# EAGLE design Santa (EAGLE 7.6.0)
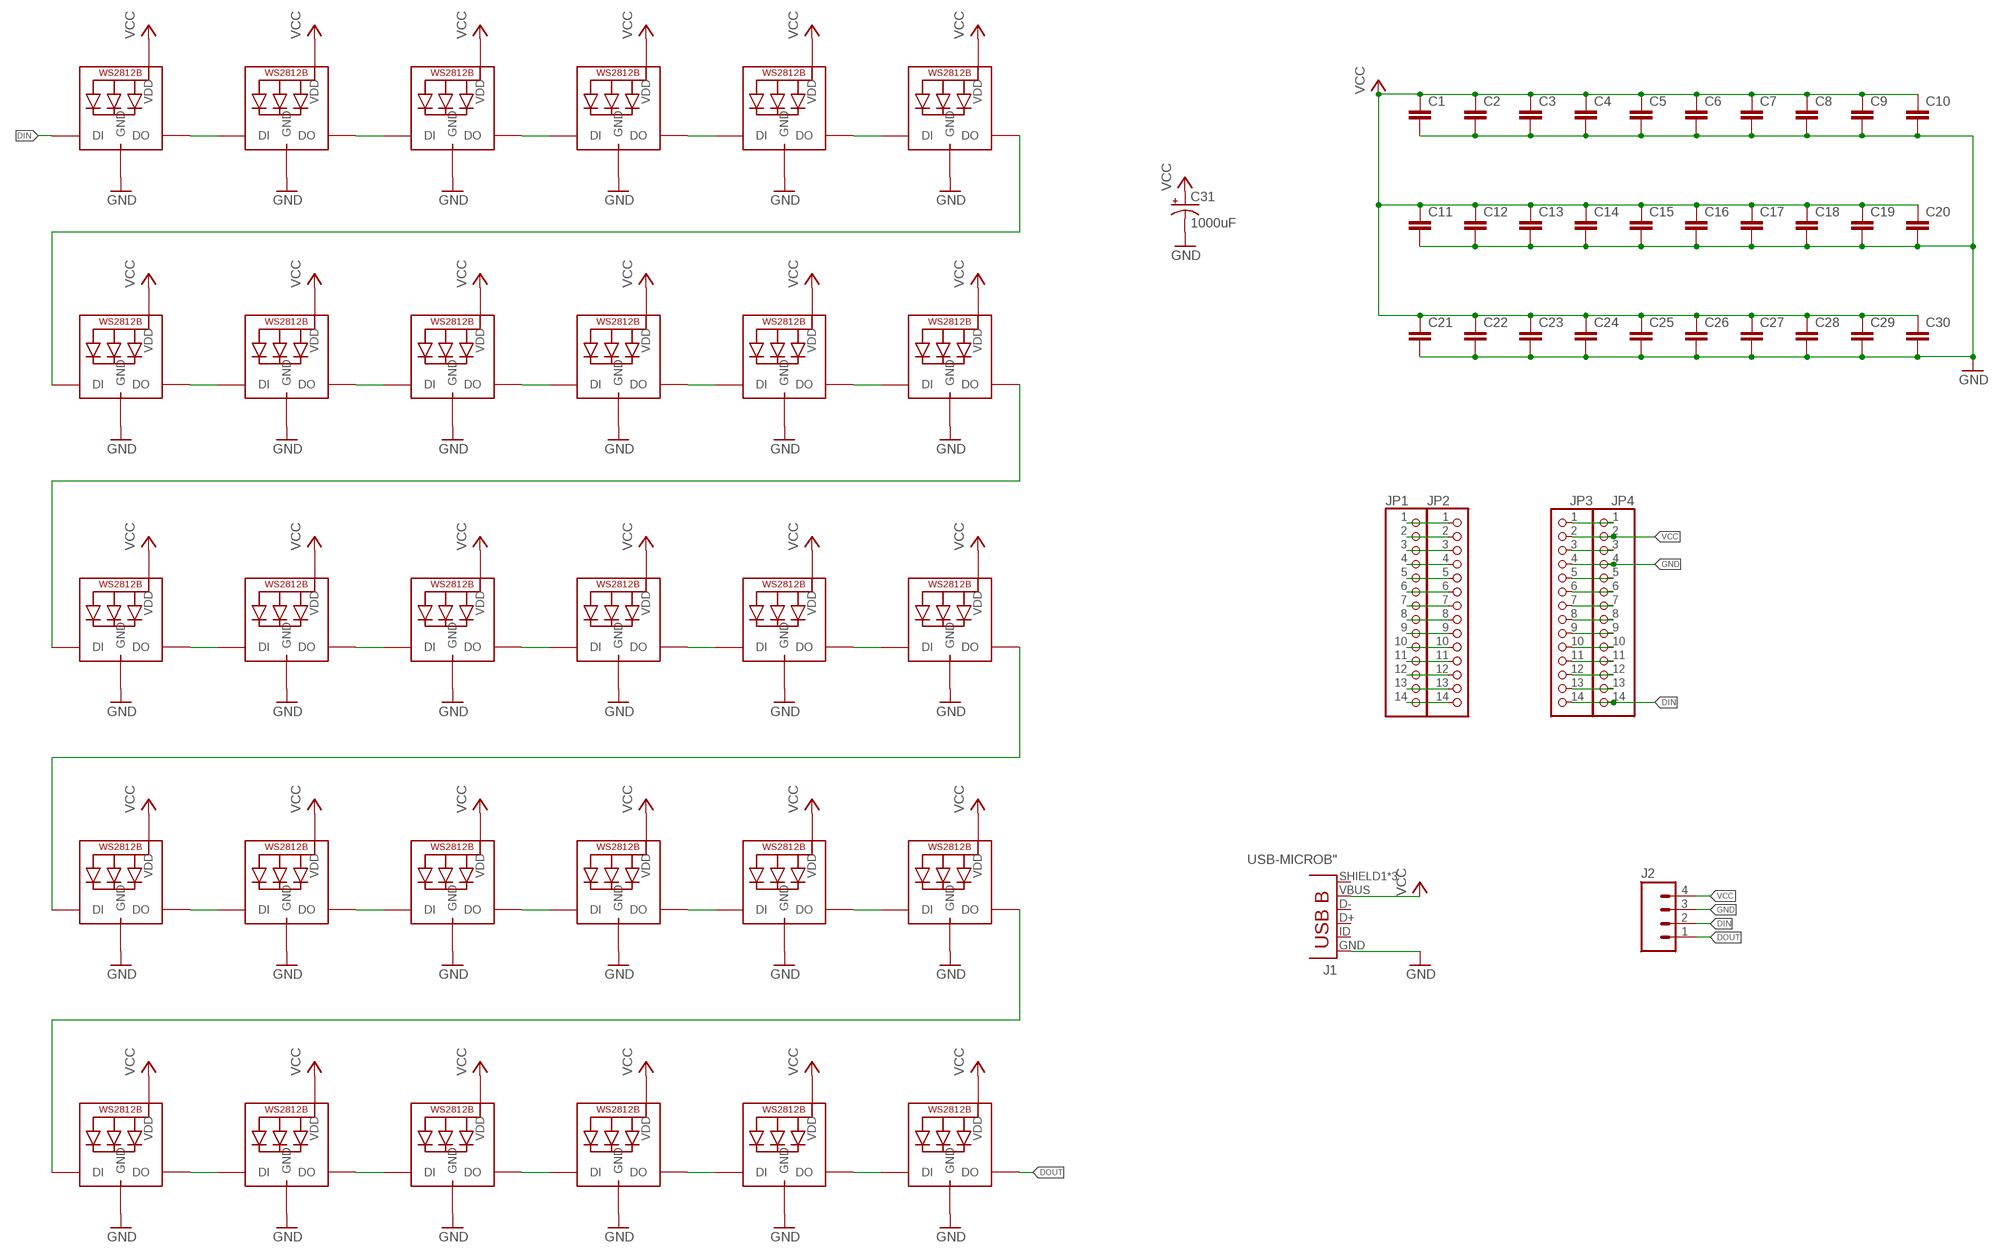
[diagram p0: schematic, sheet 1]

## Parts
C1  CC0603  [C0603]
C2  CC0603  [C0603]
C3  CC0603  [C0603]
C4  CC0603  [C0603]
C5  CC0603  [C0603]
C6  CC0603  [C0603]
C7  CC0603  [C0603]
C8  CC0603  [C0603]
C9  CC0603  [C0603]
C10  CC0603  [C0603]
C11  CC0603  [C0603]
C12  CC0603  [C0603]
C13  CC0603  [C0603]
C14  CC0603  [C0603]
C15  CC0603  [C0603]
C16  CC0603  [C0603]
C17  CC0603  [C0603]
C18  CC0603  [C0603]
C19  CC0603  [C0603]
C20  CC0603  [C0603]
C21  CC0603  [C0603]
C22  CC0603  [C0603]
C23  CC0603  [C0603]
C24  CC0603  [C0603]
C25  CC0603  [C0603]
C26  CC0603  [C0603]
C27  CC0603  [C0603]
C28  CC0603  [C0603]
C29  CC0603  [C0603]
C30  CC0603  [C0603]
C31  1000uF  CPOL-USSMCC  [SMC_C]
J1  USB-MICROB"  [USB-B-MICRO-SMD_V03]
J2  M04LOCK_LONGPADS  [1X04_LOCK_LONGPADS]
JP1  PINHD-1X14-CB  [1X14-CB]
JP2  PINHD-1X14-CB  [1X14-CB]
JP3  PINHD-1X14-CB  [1X14-CB]
JP4  PINHD-1X14-CB  [1X14-CB]
LED1  WS2812B5050  [WS2812B]
LED2  WS2812B5050  [WS2812B]
LED3  WS2812B5050  [WS2812B]
LED4  WS2812B5050  [WS2812B]
LED5  WS2812B5050  [WS2812B]
LED6  WS2812B5050  [WS2812B]
LED7  WS2812B5050  [WS2812B]
LED8  WS2812B5050  [WS2812B]
LED9  WS2812B5050  [WS2812B]
LED10  WS2812B5050  [WS2812B]
LED11  WS2812B5050  [WS2812B]
LED12  WS2812B5050  [WS2812B]
LED13  WS2812B5050  [WS2812B]
LED14  WS2812B5050  [WS2812B]
LED15  WS2812B5050  [WS2812B]
LED16  WS2812B5050  [WS2812B]
LED17  WS2812B5050  [WS2812B]
LED18  WS2812B5050  [WS2812B]
LED19  WS2812B5050  [WS2812B]
LED20  WS2812B5050  [WS2812B]
LED21  WS2812B5050  [WS2812B]
LED22  WS2812B5050  [WS2812B]
LED23  WS2812B5050  [WS2812B]
LED24  WS2812B5050  [WS2812B]
LED25  WS2812B5050  [WS2812B]
LED26  WS2812B5050  [WS2812B]
LED27  WS2812B5050  [WS2812B]
LED28  WS2812B5050  [WS2812B]
LED29  WS2812B5050  [WS2812B]
LED30  WS2812B5050  [WS2812B]

## Nets
DIN: J2.2 JP3.14 JP4.14 LED1.4-DIN(DI)
DOUT: J2.1 LED30.2-DOUT(DO)
GND: C1.2 C2.2 C3.2 C4.2 C5.2 C6.2 C7.2 C8.2 C9.2 C10.2 C11.2 C12.2 C13.2 C14.2 C15.2 C16.2 C17.2 C18.2 C19.2 C20.2 C21.2 C22.2 C23.2 C24.2 C25.2 C26.2 C27.2 C28.2 C29.2 C30.2 C31.- J1.GND J2.3 JP3.4 JP4.4 LED1.3-GND(GND) LED2.3-GND(GND) LED3.3-GND(GND) LED4.3-GND(GND) LED5.3-GND(GND) LED6.3-GND(GND) LED7.3-GND(GND) LED8.3-GND(GND) LED9.3-GND(GND) LED10.3-GND(GND) LED11.3-GND(GND) LED12.3-GND(GND) LED13.3-GND(GND) LED14.3-GND(GND) LED15.3-GND(GND) LED16.3-GND(GND) LED17.3-GND(GND) LED18.3-GND(GND) LED19.3-GND(GND) LED20.3-GND(GND) LED21.3-GND(GND) LED22.3-GND(GND) LED23.3-GND(GND) LED24.3-GND(GND) LED25.3-GND(GND) LED26.3-GND(GND) LED27.3-GND(GND) LED28.3-GND(GND) LED29.3-GND(GND) LED30.3-GND(GND)
N$1: LED1.2-DOUT(DO) LED2.4-DIN(DI)
N$2: LED2.2-DOUT(DO) LED3.4-DIN(DI)
N$3: LED3.2-DOUT(DO) LED4.4-DIN(DI)
N$4: LED4.2-DOUT(DO) LED5.4-DIN(DI)
N$5: LED5.2-DOUT(DO) LED6.4-DIN(DI)
N$6: LED7.2-DOUT(DO) LED8.4-DIN(DI)
N$7: LED8.2-DOUT(DO) LED9.4-DIN(DI)
N$8: LED9.2-DOUT(DO) LED10.4-DIN(DI)
N$9: LED10.2-DOUT(DO) LED11.4-DIN(DI)
N$10: LED11.2-DOUT(DO) LED12.4-DIN(DI)
N$11: LED13.2-DOUT(DO) LED14.4-DIN(DI)
N$12: LED14.2-DOUT(DO) LED15.4-DIN(DI)
N$13: LED15.2-DOUT(DO) LED16.4-DIN(DI)
N$14: LED16.2-DOUT(DO) LED17.4-DIN(DI)
N$15: LED17.2-DOUT(DO) LED18.4-DIN(DI)
N$16: LED19.2-DOUT(DO) LED20.4-DIN(DI)
N$17: LED20.2-DOUT(DO) LED21.4-DIN(DI)
N$18: LED21.2-DOUT(DO) LED22.4-DIN(DI)
N$19: LED22.2-DOUT(DO) LED23.4-DIN(DI)
N$20: LED23.2-DOUT(DO) LED24.4-DIN(DI)
N$21: LED25.2-DOUT(DO) LED26.4-DIN(DI)
N$22: LED26.2-DOUT(DO) LED27.4-DIN(DI)
N$23: LED27.2-DOUT(DO) LED28.4-DIN(DI)
N$24: LED28.2-DOUT(DO) LED29.4-DIN(DI)
N$25: LED29.2-DOUT(DO) LED30.4-DIN(DI)
N$26: LED6.2-DOUT(DO) LED7.4-DIN(DI)
N$27: LED12.2-DOUT(DO) LED13.4-DIN(DI)
N$28: LED18.2-DOUT(DO) LED19.4-DIN(DI)
N$29: LED24.2-DOUT(DO) LED25.4-DIN(DI)
N$30: JP1.1 JP2.1
N$31: JP1.2 JP2.2
N$32: JP1.3 JP2.3
N$33: JP1.4 JP2.4
N$34: JP1.5 JP2.5
N$35: JP1.6 JP2.6
N$36: JP1.7 JP2.7
N$37: JP1.8 JP2.8
N$38: JP1.9 JP2.9
N$39: JP1.10 JP2.10
N$40: JP1.11 JP2.11
N$41: JP1.12 JP2.12
N$42: JP1.13 JP2.13
N$43: JP1.14 JP2.14
N$44: JP3.1 JP4.1
N$46: JP3.3 JP4.3
N$48: JP3.5 JP4.5
N$49: JP3.6 JP4.6
N$50: JP3.7 JP4.7
N$51: JP3.8 JP4.8
N$52: JP3.9 JP4.9
N$53: JP3.10 JP4.10
N$54: JP3.11 JP4.11
N$55: JP3.12 JP4.12
N$56: JP3.13 JP4.13
VCC: C1.1 C2.1 C3.1 C4.1 C5.1 C6.1 C7.1 C8.1 C9.1 C10.1 C11.1 C12.1 C13.1 C14.1 C15.1 C16.1 C17.1 C18.1 C19.1 C20.1 C21.1 C22.1 C23.1 C24.1 C25.1 C26.1 C27.1 C28.1 C29.1 C30.1 C31.+ J1.VBUS J2.4 JP3.2 JP4.2 LED1.1-VDD(VDD) LED2.1-VDD(VDD) LED3.1-VDD(VDD) LED4.1-VDD(VDD) LED5.1-VDD(VDD) LED6.1-VDD(VDD) LED7.1-VDD(VDD) LED8.1-VDD(VDD) LED9.1-VDD(VDD) LED10.1-VDD(VDD) LED11.1-VDD(VDD) LED12.1-VDD(VDD) LED13.1-VDD(VDD) LED14.1-VDD(VDD) LED15.1-VDD(VDD) LED16.1-VDD(VDD) LED17.1-VDD(VDD) LED18.1-VDD(VDD) LED19.1-VDD(VDD) LED20.1-VDD(VDD) LED21.1-VDD(VDD) LED22.1-VDD(VDD) LED23.1-VDD(VDD) LED24.1-VDD(VDD) LED25.1-VDD(VDD) LED26.1-VDD(VDD) LED27.1-VDD(VDD) LED28.1-VDD(VDD) LED29.1-VDD(VDD) LED30.1-VDD(VDD)
Unconnected: J1.D+ J1.D- J1.ID(USBID) J1.SHIELD1(SHIELD) J1.SHIELD2(SHIELD) J1.SHIELD3(SHIELD)

## Library data of the parts
C1-C30 = eagle-ltspice:C: CAPACITOR, European symbol; SPICEMODEL: NONE; SPICEPREFIX: C
C31 = rcl:CPOL-US: POLARIZED CAPACITOR, American symbol
J1 = SparkFun-Connectors:USB-MICROB; PROD_ID: CONN-11752
J2 = SparkFun-Connectors:M04: Header 4 Standard 4-pin 0.1" header. Use with straight break away headers (SKU : PRT-00116), right angle break away headers (PRT-00553), swiss pins (PRT-00743), machine pins (PRT-00117), and female headers (PRT-00115). Molex polarized connector foot print use with SKU : PRT-08231 with associated crimp pins and housings. 1MM SMD Version SKU: PRT-10208; PROD_ID: CONN-09696
JP1-JP4 = adafruit:PINHD-1X14: PIN HEADER
LED1-LED30 = adafruit:WS2812B

## Board
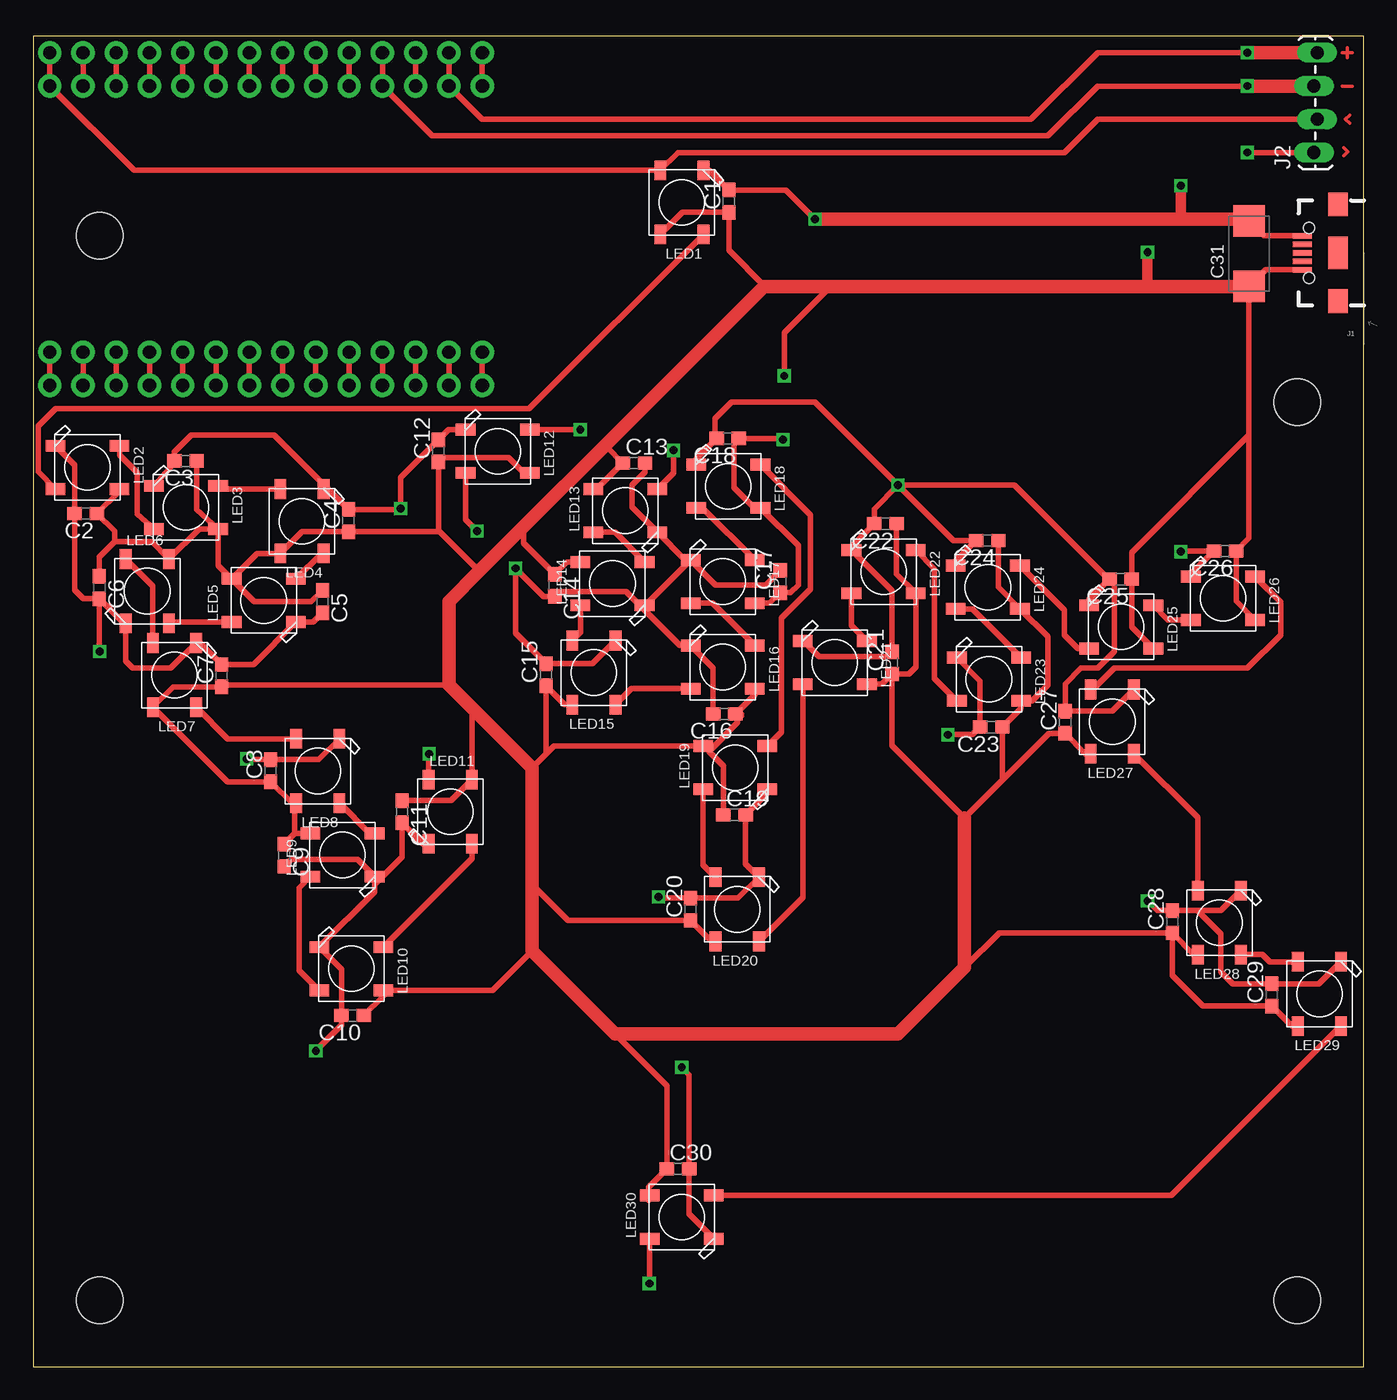
[diagram p1: board, top side]
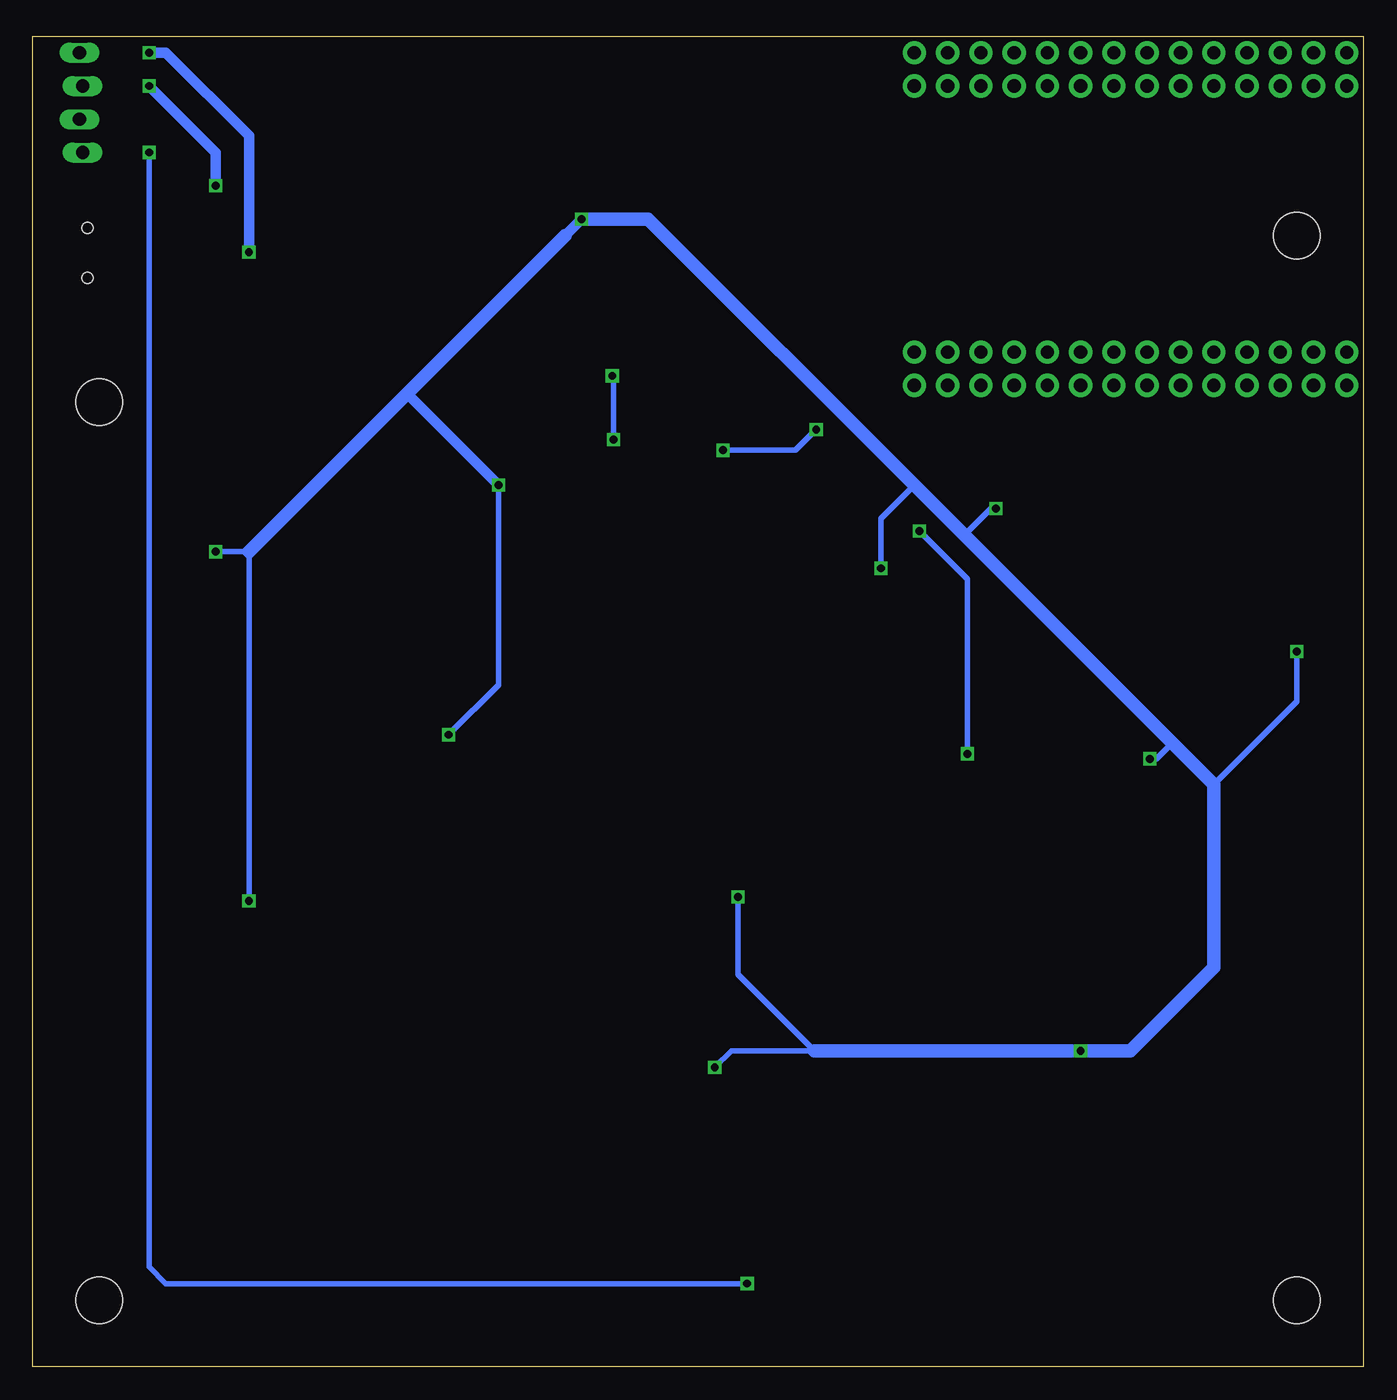
[diagram p2: board, bottom side, seen from below]

Size 101.6 x 101.6 mm. Coordinates in mm from the lower left corner, seen from the top.
Outline: 0,0 101.6,0 101.6,101.6 0,101.6 0,0
Copper layers (1*16): Top 0.035mm / dielectric 1.5mm / Bottom 0.035mm
Design rules "default": minimum track width 10mil, minimum drill 24mil, track to track 8mil, track to pad 8mil, pad to pad 8mil, via to via 8mil, smd to smd 8mil, copper to edge 40mil, drill to drill 8mil, minimum pad ring 10mil, minimum via ring 8mil, stop-mask expansion 4mil, vias tented up to drill 0mil, thermal gap 10mil
Holes 3.56 mm at 5.08,5.08 96.52,5.08 96.52,73.66 5.08,86.36

### Footprints (pad centres in the part's own frame; a part is rotated, then mirrored left to right if it is on the bottom)
C0603 = smd 1.1 x 1: 1 -0.85,0; 2 0.85,0
SMC_C = smd 2.4 x 2.4: + -2.5,0; - 2.5,0
USB-B-MICRO-SMD_V03 = smd 1.45 x 0.4: D+ 2.725,0; D- 2.725,0.65; GND 2.725,-1.3; ID 2.725,-0.65; VBUS 2.725,1.3 | smd 1.5 x 1.8: SHIELD1 0,3.685; SHIELD2 0,-3.685 | smd 1.5 x 2.5: SHIELD3 0,0 | hole 0.85: 2.2,1.9; 2.2,-1.9
1X04_LOCK_LONGPADS = drill 1.016 long: 1 0,0; 2 2.54,-0.254; 3 5.08,0; 4 7.62,-0.254
1X14-CB = drill 1.016 pad 1.778: 1 -16.51,0; 2 -13.97,0; 3 -11.43,0; 4 -8.89,0; 5 -6.35,0; 6 -3.81,0; 7 -1.27,0; 8 1.27,0; 9 3.81,0; 10 6.35,0; 11 8.89,0; 12 11.43,0; 13 13.97,0; 14 16.51,0
WS2812B = smd 1.5 x 0.9: 1-VDD 2.45,-1.65; 2-DOUT 2.45,1.65; 3-GND -2.45,1.65; 4-DIN -2.45,-1.65

### Placement (x,y rotation side)
C1  53.12,88.99 90 top
C2  4.02,65.15 180 top
C3  11.64,69.17 180 top
C4  24.08,64.6 90 top
C5  22.1,58.42 270 top
C6  5.06,59.5 270 top
C7  14.41,52.77 90 top
C8  18.14,45.51 90 top
C9  19.15,39.05 270 top
C10  24.4,26.82 180 top
C11  28.17,42.37 270 top
C12  30.94,69.93 90 top
C13  45.87,69 0 top
C14  39.83,59.67 270 top
C15  39.16,52.83 90 top
C16  52.77,49.85 180 top
C17  57.05,59.95 90 top
C18  53.04,70.88 180 top
C19  53.55,42.14 0 top
C20  50.21,34.93 90 top
C21  65.59,53.74 90 top
C22  65.08,64.36 180 top
C23  73.16,48.83 180 top
C24  72.85,63.09 180 top
C25  83.03,60.13 180 top
C26  91.01,62.29 180 top
C27  78.8,49.21 90 top
C28  86.98,33.97 90 top
C29  94.57,28.39 90 top
C30  49.24,15.11 0 top
C31  92.84,84.98 90 top
J1  99.63,85.05 180 top
J2  97.79,92.71 90 top
JP1  17.78,74.93 180 top
JP2  17.78,77.47 180 top
JP3  17.78,97.79 180 top
JP4  17.78,100.33 180 top
LED1  49.53,88.9 270 top
LED2  4.15,68.66 0 top
LED3  11.68,65.62 0 top
LED4  20.53,64.56 270 top
LED5  17.61,58.5 180 top
LED6  8.72,59.22 90 top
LED7  10.79,52.81 270 top
LED8  21.74,45.49 270 top
LED9  23.62,39.07 180 top
LED10  24.3,30.39 0 top
LED11  31.86,42.38 90 top
LED12  35.48,69.89 0 top
LED13  45.21,65.36 180 top
LED14  44.24,59.8 180 top
LED15  42.82,53 270 top
LED16  52.66,53.42 0 top
LED17  52.66,59.94 0 top
LED18  53.09,67.23 0 top
LED19  53.62,45.74 180 top
LED20  53.76,34.93 270 top
LED21  61.21,53.76 0 top
LED22  64.94,60.71 0 top
LED23  72.98,52.49 0 top
LED24  72.9,59.52 0 top
LED25  83.08,56.49 0 top
LED26  90.85,58.67 0 top
LED27  82.4,49.25 270 top
LED28  90.57,33.91 270 top
LED29  98.21,28.47 270 top
LED30  49.53,11.43 180 top

### Tracks (layer width: path | path; a pad name or v marks a point on that pad's centre or on a via)
DIN
  Top 0.406: JP4.14 JP3.14 7.71,91.35 LED1.4-DIN 49.24,92.71 78.74,92.71 81.28,95.25 J2.2
DOUT  (via drill 0.6)
  Top 0.406: J2.1 v92.71,92.71 | v47.05,6.35 47.05,9.75 LED30.2-DOUT
  Bottom 0.406: v92.71,92.71 92.71,7.62 91.44,6.35 v47.05,6.35
GND  (via drill 0.6)
  Top 0.406: JP4.4 JP3.4 30.48,93.98 77.47,93.98 81.28,97.79 v92.71,97.79 | LED3.3-GND 10.79,68.99 C3.2 10.79,69.85 12.06,71.12 18.42,71.12 C4.2 | LED2.3-GND 3.17,68.84 C2.2 3.17,59.31 3.84,58.65 C6.2 | C4.2 22.53,67.01 LED4.3-GND | C6.2 6.93,56.77 LED6.3-GND 7.07,53.89 7.62,53.34 10.52,53.34 LED7.3-GND 12.77,55.26 C7.2 16.82,53.62 LED5.3-GND 21.38,56.85 C5.2 | LED8.3-GND 21.81,46.36 C8.2 16.38,46.36 v16.32,46.42 | C9.2 19.69,38.73 24.77,38.73 LED9.3-GND 26.07,36.83 | 46.31,58.15 45.28,59.18 40.2,59.18 C14.2 38.97,58.82 v36.83,60.96 36.83,56.02 C15.2 42.7,53.69 LED15.3-GND | 46.31,58.15 LED14.3-GND 46.76,58.15 LED17.3-GND | LED18.3-GND 50.64,69.33 C18.2 52.07,71 52.07,72.39 53.34,73.66 59.69,73.66 v66.04,67.31 | C17.2 55.94,59.69 52.12,59.69 LED17.3-GND | C16.2 51.92,53.37 LED16.3-GND 49.38,55.07 46.31,58.15 | LED19.3-GND 56.07,43.8 C19.2 54.4,38.38 LED20.3-GND 53.81,35.78 C20.2 47.85,35.78 v47.75,35.88 | LED21.3-GND 58.82,55.41 60.01,54.23 65.23,54.23 C21.2 65.59,59.25 LED22.3-GND 62.49,62.62 C22.2 64.23,65.5 v66.04,67.31 | LED23.3-GND 72.31,52.37 C23.2 71.73,48.26 v69.85,48.26 | LED24.3-GND 70.45,61.54 C24.2 70.25,63.09 v66.04,67.31 | LED27.3-GND 82.41,50.06 C27.2 78.8,52.13 80.01,53.34 81.28,53.34 82.55,54.61 82.55,59.69 | LED25.3-GND 80.63,58.58 C25.2 82.55,59.76 82.55,59.69 | LED26.3-GND 88.4,60.53 C26.2 87.69,62.29 v87.63,62.23 | LED28.3-GND 90.69,34.82 88.9,34.82 | 88.9,34.82 C28.2 85.83,34.82 v85.09,35.56 | LED29.3-GND 98.18,29.24 C29.2 91.6,29.24 90.68,30.16 90.68,33.05 88.9,34.82 | J1.GND 93.97,86.35 C31.- | LED1.3-GND 51.61,91.35 C1.2 57.48,89.84 v59.69,87.63
  Top 0.406: LED12.3-GND 31.71,71.55 C12.2 28.07,67.9 v28.07,65.53 27.99,65.45 C4.2 | C6.2 5.06,54.63 v5.08,54.61 | v21.59,24.13 23.55,26.09 C10.2 23.55,30.34 LED10.3-GND 26.07,36.27 26.07,36.83 | LED11.3-GND 29.77,39.92 C11.2 28.17,38.93 26.07,36.83 | C13.2 46.72,68.31 45.72,67.31 45.72,65.66 LED13.3-GND 49.78,61.59 LED17.3-GND | LED30.3-GND 50.09,11.67 C30.2 50.09,22.3 v49.53,22.86 | 82.55,59.69 74.93,67.31 v66.04,67.31
  Top 0.813: v87.63,90.17 87.63,87.63
  Top 1.016: J2.3 v92.71,97.79 | C31.- 92.69,87.63 87.63,87.63 v59.69,87.63
  Bottom 0.406: v28.07,65.53 28.45,65.53 30.48,63.5 | v5.08,54.61 5.08,50.8 11.43,44.45 | v36.83,60.96 36.83,64.77 34.29,67.31 | v16.32,46.42 15.81,46.42 14.61,47.62 | v49.53,22.86 48.26,24.13 41.91,24.13 47.75,29.97 v47.75,35.88 | v85.09,35.56 85.09,62.23 v87.63,62.23 | v69.85,48.26 66.04,52.07 v66.04,67.31
  Bottom 0.813: v92.71,97.79 87.63,92.71 v87.63,90.17 | v66.04,67.31 73.03,74.3 | 60.96,86.36 v59.69,87.63
  Bottom 1.016: v59.69,87.63 54.61,87.63 34.29,67.31 30.48,63.5 14.61,47.62 11.43,44.45 11.43,30.48 17.78,24.13 v21.59,24.13 41.91,24.13 | 60.96,86.36 73.03,74.3 85.09,62.23
N$1
  Top 0.406: LED1.2-DOUT 37.88,73.15 1.71,73.15 0.38,71.82 0.38,68.33 LED2.4-DIN
N$2
  Top 0.406: LED2.2-DOUT 6.6,69.6 7.94,68.26 7.94,65.09 LED3.4-DIN
N$3
  Top 0.406: LED3.2-DOUT 14.22,67.01 LED4.4-DIN
N$4
  Top 0.406: LED4.2-DOUT 22.01,62.11 LED5.4-DIN
N$5
  Top 0.406: LED5.2-DOUT 10.45,56.85 LED6.4-DIN
N$6
  Top 0.406: LED7.2-DOUT 14.87,47.94 LED8.4-DIN
N$7
  Top 0.406: LED8.2-DOUT 25.7,40.72 LED9.4-DIN
N$8
  Top 0.406: LED9.2-DOUT 20.32,36.57 20.32,30.27 LED10.4-DIN
N$9
  Top 0.406: LED10.2-DOUT 33.51,38.8 LED11.4-DIN
N$10  (via drill 0.6)
  Top 0.406: LED11.2-DOUT 30.21,46.78 v30.23,46.8 | v33.91,63.82 33.03,64.7 LED12.4-DIN
  Bottom 0.406: v30.23,46.8 30.23,60.13 v33.91,63.82
N$11
  Top 0.406: LED13.2-DOUT 44.42,63.71 LED14.4-DIN
N$12
  Top 0.406: LED14.2-DOUT 41.79,56.07 LED15.4-DIN
N$13
  Top 0.406: LED15.2-DOUT 45.69,51.77 LED16.4-DIN
N$14
  Top 0.406: LED16.2-DOUT 51.89,58.29 LED17.4-DIN
N$15
  Top 0.406: LED17.2-DOUT 51.13,65.58 LED18.4-DIN
N$16
  Top 0.406: LED19.2-DOUT 51.17,38.32 LED20.4-DIN
N$17
  Top 0.406: LED20.2-DOUT 58.76,35.83 LED21.4-DIN
N$18
  Top 0.406: LED21.2-DOUT 62.49,56.59 LED22.4-DIN
N$19
  Top 0.406: LED22.2-DOUT 68.83,60.91 68.83,52.54 LED23.4-DIN
N$20
  Top 0.406: LED23.2-DOUT 71.7,57.87 LED24.4-DIN
N$21
  Top 0.406: LED25.2-DOUT 86.65,57.02 LED26.4-DIN
N$22
  Top 0.406: LED26.2-DOUT 95.25,58.37 95.25,55.88 92.71,53.34 82.55,53.34 80.92,51.7 LED27.4-DIN
N$23
  Top 0.406: LED27.2-DOUT 88.92,41.94 LED28.4-DIN
N$24
  Top 0.406: LED28.2-DOUT 92.26,31.5 93.85,31.5 94.43,30.92 LED29.4-DIN
N$25
  Top 0.406: LED29.2-DOUT 86.92,13.08 LED30.4-DIN
N$26
  Top 0.406: LED6.2-DOUT 9.14,59.6 LED7.4-DIN
N$27  (via drill 0.6)
  Top 0.406: LED12.2-DOUT 37.95,71.56 v41.78,71.56 | v48.9,69.98 48.9,68.25 LED13.4-DIN
  Bottom 0.406: v41.78,71.56 43.37,69.98 v48.9,69.98
N$28
  Top 0.406: LED19.4-DIN 57.15,48.48 57.15,57.15 59.37,59.37 59.37,65.04 LED18.2-DOUT
N$29
  Top 0.406: LED24.2-DOUT 78.74,57.78 78.74,55.88 79.78,54.84 LED25.4-DIN
N$30
  Top 0.406: JP2.1 JP1.1
N$31
  Top 0.406: JP2.2 JP1.2
N$32
  Top 0.406: JP2.3 JP1.3
N$33
  Top 0.406: JP2.4 JP1.4
N$34
  Top 0.406: JP1.5 JP2.5
N$35
  Top 0.406: JP1.6 JP2.6
N$36
  Top 0.406: JP2.7 JP1.7
N$37
  Top 0.406: JP2.8 JP1.8
N$38
  Top 0.406: JP2.9 JP1.9
N$39
  Top 0.406: JP2.10 JP1.10
N$40
  Top 0.406: JP2.11 JP1.11
N$41
  Top 0.406: JP2.12 JP1.12
N$42
  Top 0.406: JP2.13 JP1.13
N$43
  Top 0.406: JP2.14 JP1.14
N$44
  Top 0.406: JP4.1 JP3.1
N$45
  Top 0.254: 100.33,100.71 100.33,100.33 | 100.33,99.95 100.33,100.33 | 100.33,100.33 99.95,100.33 | 100.33,100.33 100.71,100.33
N$46
  Top 0.406: JP4.3 JP3.3
N$47
  Top 0.254: 99.95,97.79 100.71,97.79
N$48
  Top 0.406: JP4.5 JP3.5
N$49
  Top 0.406: JP4.6 JP3.6
N$50
  Top 0.406: JP4.7 JP3.7
N$51
  Top 0.406: JP4.8 JP3.8
N$52
  Top 0.406: JP4.9 JP3.9
N$53
  Top 0.406: JP4.10 JP3.10
N$54
  Top 0.406: JP4.11 JP3.11
N$55
  Top 0.406: JP4.12 JP3.12
N$56
  Top 0.406: JP4.13 JP3.13
N$57
  Top 0.254: 100.08,93.09 100.39,92.77 100.08,92.46
N$58
  Top 0.254: 100.52,95.57 100.2,95.25 100.52,94.93
VCC  (via drill 0.6)
  Top 0.406: JP4.2 JP3.2 34.29,95.25 76.2,95.25 81.28,100.33 93.98,100.33 | C3.1 12.49,65.44 LED3.1-VDD | LED2.1-VDD 6.6,66.88 C2.1 | 6.22,62.99 9.05,62.99 LED6.1-VDD 12.66,63.97 LED3.1-VDD | 6.22,62.99 5.06,61.83 C6.1 | C5.1 21.25,58.42 16.89,58.42 LED5.1-VDD | C9.1 19.98,40.72 | 19.98,40.72 LED9.1-VDD | C10.1 26.75,28.31 LED10.1-VDD 35.09,28.75 38.1,31.75 | LED14.1-VDD 40.76,61.45 C14.1 37.47,62.88 37.47,64.14 | LED15.1-VDD 40.59,50.55 C15.1 39.16,46.78 | LED17.1-VDD 56.24,58.29 C17.1 57.83,59.1 58.42,59.69 58.42,62.69 LED18.1-VDD 55.07,65.58 53.53,67.12 53.53,70.52 C18.1 57.16,70.88 v57.25,70.79 | LED16.1-VDD 55.11,51.34 C16.1 54.1,49.85 54.1,49.7 53.8,50 53.8,49.17 51.59,46.97 | C19.1 52.7,45.85 51.59,46.97 | 51.59,46.97 LED19.1-VDD 39.77,47.39 39.16,46.78 | LED20.1-VDD 51.81,32.48 C20.1 40.85,34.08 38.1,36.83 | LED21.1-VDD 64.82,52.12 C21.1 | C22.1 65.93,60.51 LED22.1-VDD 67.39,53.42 66.86,52.89 C21.1 | C24.1 73.7,59.52 LED24.1-VDD 77.47,55.75 77.47,52.07 76.24,50.84 LED23.1-VDD 75.43,50.26 C23.1 74.01,44.8 | LED27.1-VDD 80.36,46.8 C27.1 77.57,48.36 74.01,44.8 | LED25.1-VDD 83.88,56.49 C25.1 83.88,62.16 92.84,71.12 | LED26.1-VDD 91.86,58.46 C26.1 92.84,63.27 92.84,71.12 | C28.1 88.64,31.46 LED28.1-VDD | LED29.1-VDD 96.09,26.02 C29.1 89.3,27.54 86.98,29.86 C28.1 | C2.1 5.06,64.96 | LED5.1-VDD 17.11,62.11 LED4.1-VDD 20.53,63.75 C4.1 31.05,63.75 | J1.VBUS 94.1,83.75 C31.+ 92.84,71.12 | LED1.1-VDD 49.57,88.14 C1.1 53.12,85.24 55.88,82.48 | 31.05,63.75 30.94,63.86 C12.1 31.27,69.41 36.32,69.41 37.48,68.25 LED12.1-VDD | 31.05,63.75 34.07,60.74 | 6.22,62.99 6.22,63.8 C2.1 | 19.98,40.72 19.98,42.93 LED8.1-VDD 19.76,43.04 C8.1 14.85,44.66 LED7.1-VDD 10.7,51.92 C7.1 14.56,52.07 31.75,52.07 33.51,50.31 LED11.1-VDD 31.9,43.22 C11.1
  Top 0.406: 39.16,46.78 38.1,45.72 | LED13.1-VDD 43.03,67.01 C13.1 43.81,70.21 43.81,70.48 | LED30.1-VDD 47.08,12.79 46.99,12.7 46.99,13.72 C30.1 48.39,21.46 44.45,25.4 | 74.01,44.8 71.12,41.91 65.59,47.44 C21.1 | C28.1 73.76,33.12 71.12,30.48 | LED3.1-VDD 14.13,61.19 LED5.1-VDD | v57.35,75.65 57.35,78.94 60.9,82.48
  Top 0.813: v85.09,85.09 85.09,82.48
  Top 1.016: J2.4 93.98,100.33 v92.71,100.33 | C31.+ 85.09,82.48 60.9,82.48 55.88,82.48 55.81,82.48 43.81,70.48 37.47,64.14 34.07,60.74 31.75,58.42 31.75,52.07 38.1,45.72 38.1,36.83 38.1,31.75 44.45,25.4 66.04,25.4 71.12,30.48 71.12,41.91
  Bottom 0.406: v57.25,70.79 57.25,75.55 v57.35,75.65
  Bottom 0.813: v92.71,100.33 91.44,100.33 85.09,93.98 v85.09,85.09